# EasyEDA Pro project ProPrj_ENPHY-PCB-PROJECT-EN1B_2026-05-29.epro

# Schematic Schematic1
Board Name: Board1; Create Date: 2026-05-28; Page Name: P1; Project Name: ENPHY-PCB-PROJECT-EN1B; Schematic Name: Schematic1; Update Date: 2026-05-28; Company: EasyEDA.com; Page Size: A4; Version: V1.0
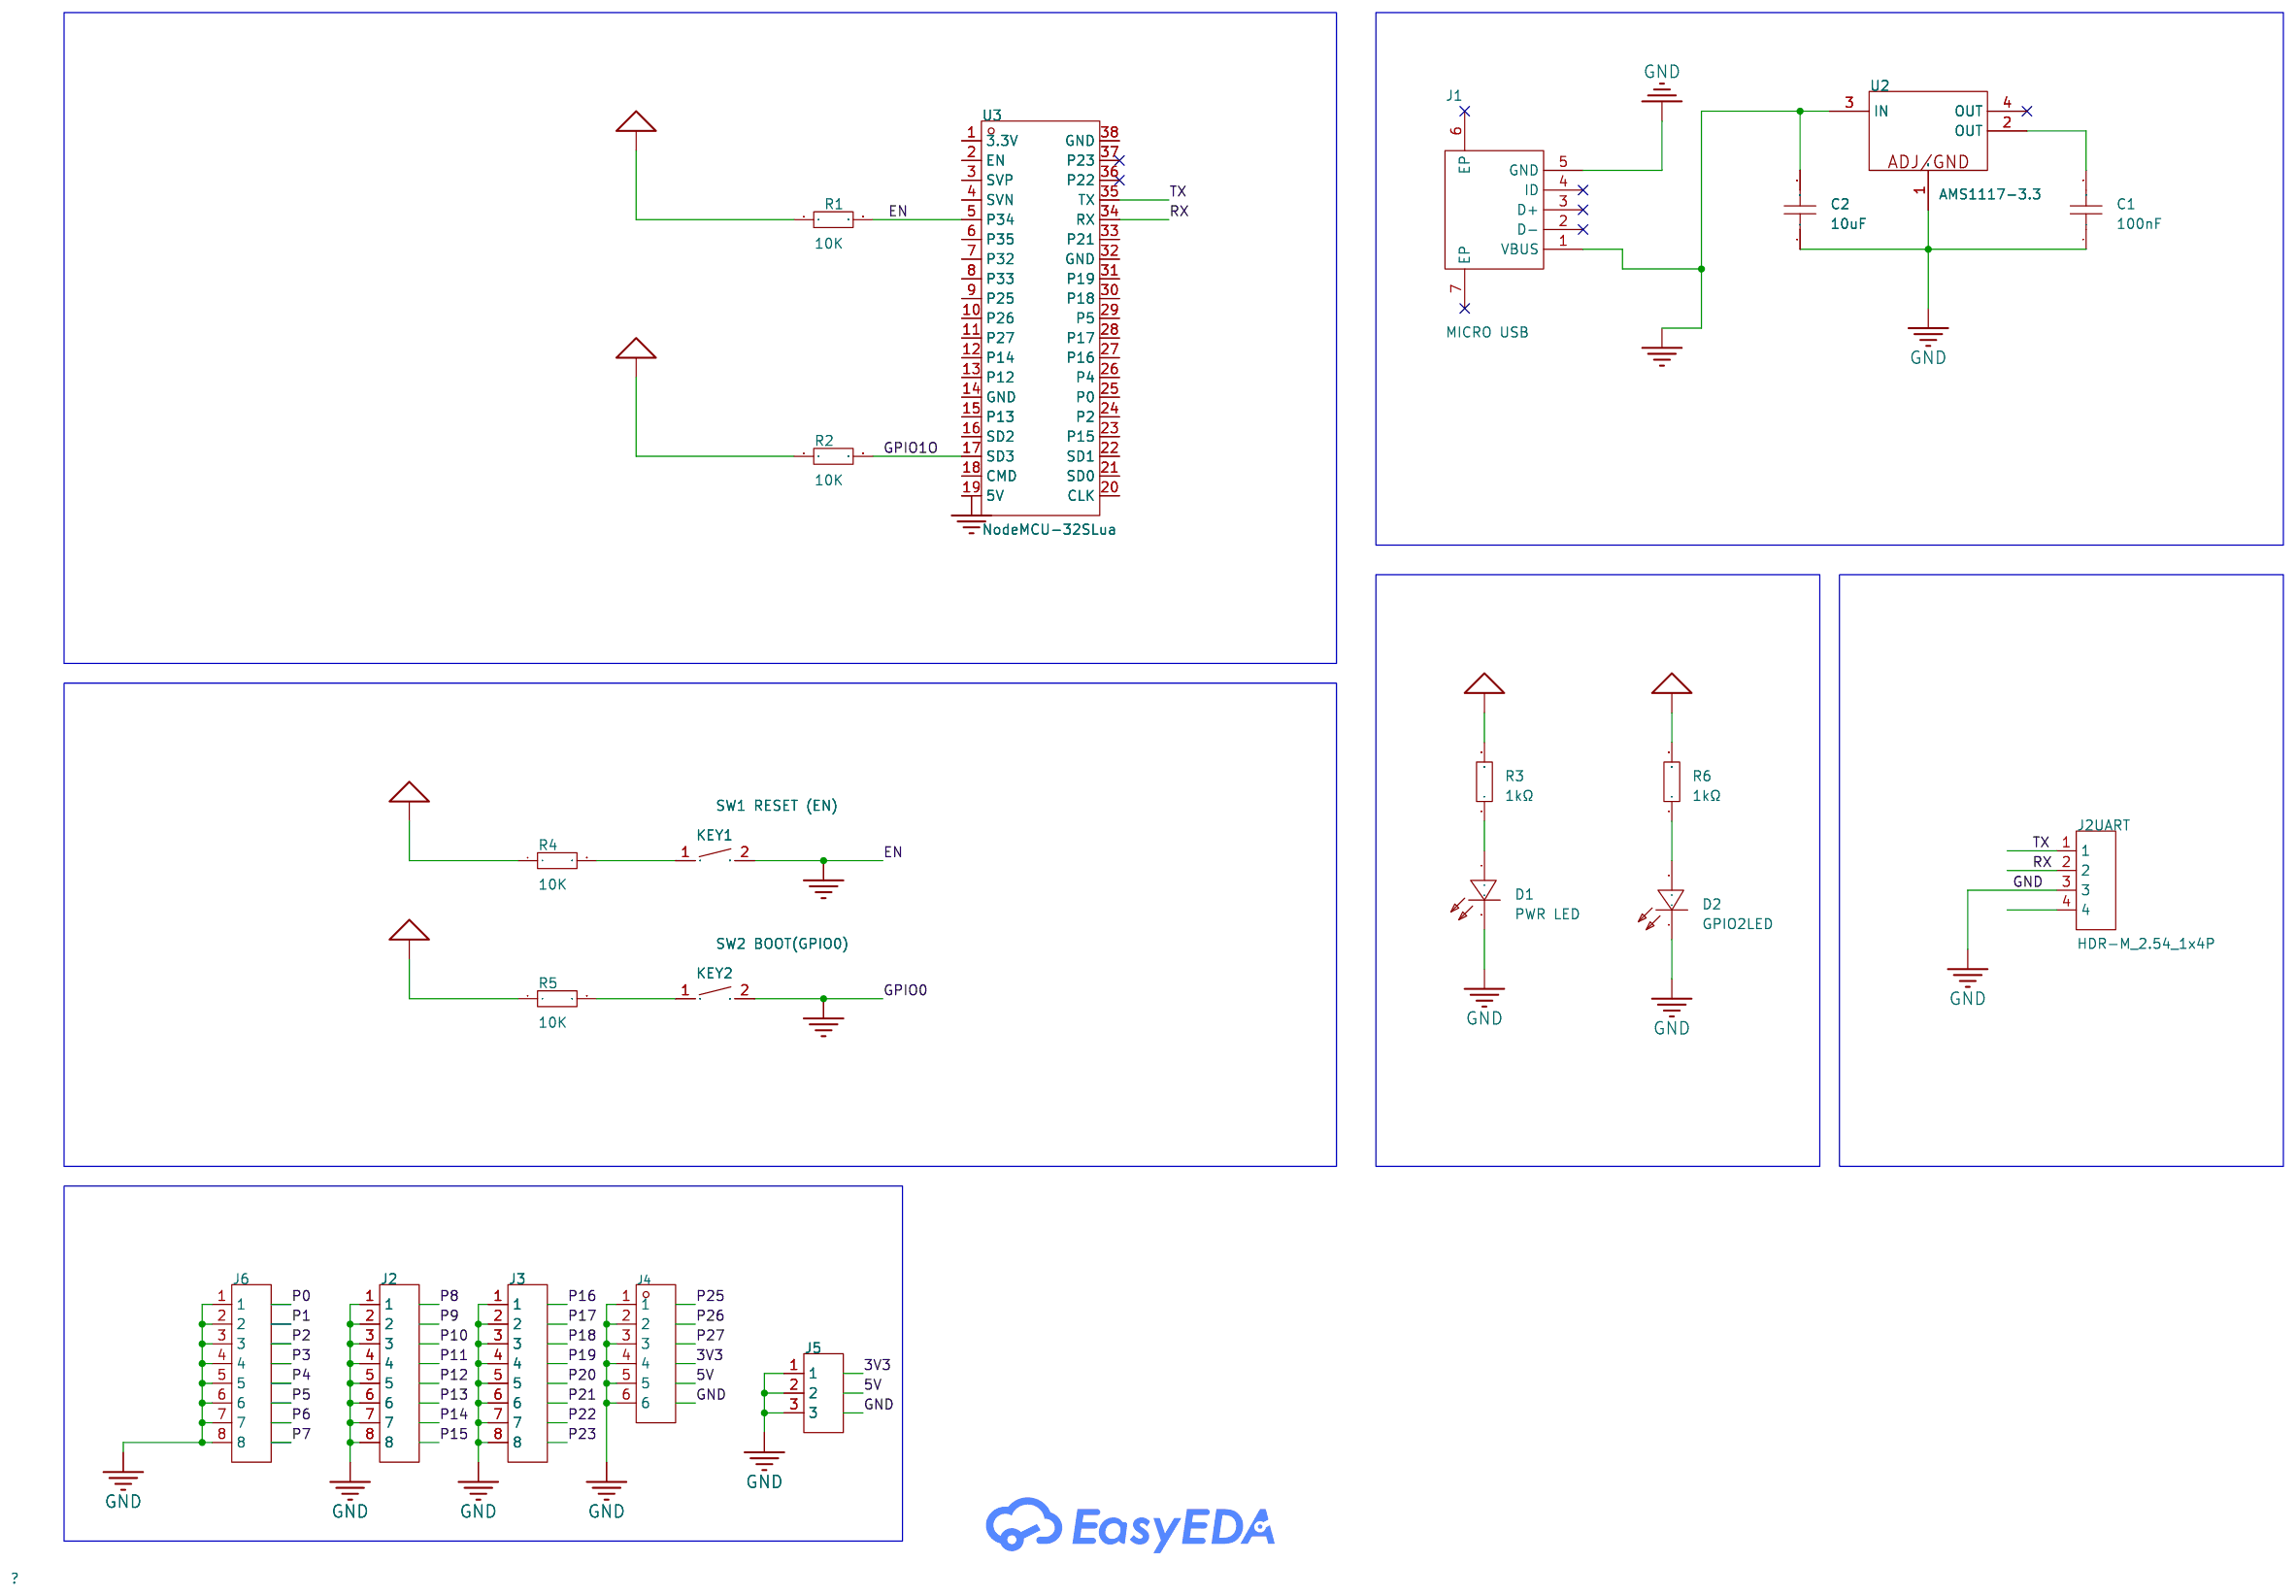
[diagram p0: schematic sheet]

## Parts
C1  100nF  [C0603]
C2  10uF  [C0603]
D1  PWR LED  [LED0603-R-RD]
D2  GPIO2LED  [LED0603-R-RD_WHITE]
J1  MICRO USB  [USB-MICRO_USB-MICRO-5P]
J2  -  [HDR-TH_8P-P2.54-V-F-1]
J2UART  HDR-M_2.54_1x4P  [HDR-TH_HDR-M_2.54_1X4P]
J3  -  [HDR-TH_8P-P2.54-V-F-1]
J4  -  [HDR-TH_6P-P2.54-V-F]
J5  -  [HDR-TH_3P-P2.54-V-F]
J6  -  [HDR-TH_8P-P2.54-V-F-1]
KEY1  SW1 RESET (EN)  [KEY-SMD_L4.0-W3.0-LS4.9-1]
KEY2  SW2 BOOT(GPIO0)  [KEY-SMD_L4.0-W3.0-LS4.9-1]
R1  10K  [R0603]
R2  10K  [R0603]
R3  1kΩ  [R0603]
R4  10K  [R0603]
R5  10K  [R0603]
R6  1kΩ  [R0805]
U2  AMS1117-3.3  [SOT-223-3_L6.4-W3.5-P2.30-LS7.0-BR]
U3  NodeMCU-32SLua  [COMM-TH_NODEMCU-32SLUA]

## Library data of the parts
C1 = CC0603KRX7R9BB104: Capacitance:100nF Tolerance:±10% Tolerance:±10% Voltage Rating:50V Temperature Coefficient:X7R; LCSC Part Name: 100nF ±10% 50V; Supplier Part: C14663; Manufacturer: YAGEO(国巨); Supplier Footprint: 0603; Datasheet: https://item.szlcsc.com/datasheet/CC0603KRX7R9BB104/15331.html; Supplier: LCSC; Tolerance: ±10%; Voltage Rating: 50V; Temperature Coefficient: X7R
C2 = CL10A106KP8NNNC: Capacitance:10uF Tolerance:±10% Tolerance:±10% Voltage Rating:10V Temperature Coefficient:X5R; LCSC Part Name: 10uF ±10% 10V; Supplier Part: C19702; Manufacturer: SAMSUNG(三星); Supplier Footprint: 0603; JLCPCB Part Class: Basic Part; Datasheet: https://item.szlcsc.com/datasheet/CL10A106KP8NNNC/20411.html; Supplier: LCSC; Tolerance: ±10%; Voltage Rating: 10V; Temperature Coefficient: X5R
D1 = LED0603-R: Supplier Part: C9900005326; Supplier Footprint: LED0603; JLCPCB Part Class: Extended Part; Supplier: LCSC
D2 = KT-0603W: Lamp Holder Type:1.6mm x 0.8mm square LED Illumination Color:White Voltage - Forward(Vf):2.6V~3.1V Voltage - Forward(Vf):2.6V~3.1V Power(Watts):100mW Forward Current:5mA Wavelength - Dominant:- Wavelength - Dominant:- Peak Wavelength:- Peak Wavelength:- D; LCSC Part Name: 0603 白灯 高亮; Supplier Part: C2290; Manufacturer: KENTO; Supplier Footprint: 0603; Datasheet: https://item.szlcsc.com/datasheet/KT-0603W/2663.html; Supplier: LCSC; Lamp Holder Type: 1.6mm x 0.8mm square LED; Illumination Color: White; Voltage - Forward(Vf): 2.6V~3.1V; Power(Watts): 100mW; Forward Current: 5mA; Diode Configuration: Discrete Diode; Lens Color: Yellow Lens; Color Temperature: 40000K~100000K; Luminous Intensity: 360mcd; Viewing Angle: 120°; Mounting Style: Top-mount; Operating Temperature: -40℃~+85℃
J1 = USB-Micro-5p_C9900014940: LCSC Part Name: USB-Micro-5p; Supplier Part: C9900014940; Manufacturer Part: USB-Micro-5p; Supplier Footprint: USB平口Micro脚长2; JLCPCB Part Class: Extended Part; Supplier: LCSC
J2 J3 J6 = HDR-F_2.54_1x8P: Supplier Footprint: Through
J2UART = HDR-M_2.54_1x4P_C9900236824: Supplier Part: C9900236824; Supplier Footprint: HDR-TH_4P-P2.54-V-M; JLCPCB Part Class: Extended Part; Supplier: LCSC
J4 = HDR-F_2.54_1x6P: Supplier Footprint: Through
J5 = HDR-F_2.54_1x3P: Supplier Footprint: Through
KEY1 KEY2 = SWITCH,TACT,1.57N,3.9X2.9MM: Supplier Part: C9900022258; Supplier Footprint: SW-SMD_2P-L4.0-W3.0; JLCPCB Part Class: Extended Part; Supplier: LCSC
R1 R2 R4 R5 = Res_0603: Supplier Footprint: 0603
R3 = 0603WAF1001T5E: Type:Thick Film Resistor Resistance:1kΩ Tolerance:±1% Tolerance:±1% Power(Watts):100mW Voltage-Supply(Max):75V Temperature Coefficient:±100ppm/℃ Temperature Coefficient:±100ppm/℃ Operating Temperature:-55℃~+155℃ Operating Temperature:-55℃~+155℃; LCSC Part Name: 1kΩ ±1% 100mW 厚膜电阻; Supplier Part: C21190; Manufacturer: UNI-ROYAL(厚声); Supplier Footprint: 0603; Datasheet: https://item.szlcsc.com/datasheet/0603WAF1001T5E/21904.html; Supplier: LCSC; Type: Thick Film Resistor; Tolerance: ±1%; Power(Watts): 100mW; Voltage-Supply(Max): 75V; Temperature Coefficient: ±100ppm/℃; Operating Temperature: -55℃~+155℃
R6 = 0805W8F1001T5E: Type:Thick Film Resistors Resistance:1kΩ Tolerance:±1% Tolerance:±1% Power(Watts): Overload Voltage (Max): Temperature Coefficient:±100ppm/℃ Temperature Coefficient:±100ppm/℃ Operating Temperature Range:-55℃~+155℃ Operating Temperature Range:-55℃~+155℃; LCSC Part Name: 1kΩ ±1% 125mW 厚膜电阻; Supplier Part: C17513; Manufacturer: UNI-ROYAL(厚声); Supplier Footprint: 0805; Datasheet: https://atta.szlcsc.com/upload/public/pdf/source/20200306/C422600_1E6D84923E4A46A82E41ADD87F860B5C.pdf; Supplier: LCSC; Type: Thick Film Resistors; Tolerance: ±1%; Temperature Coefficient: ±100ppm/℃; Operating Temperature Range: -55℃~+155℃
U2 = AMS1117-3.3: Output Type:Fixed Voltage - Supply:15V Output Voltage:3.3V Output Voltage:3.3V Output Current:1A Power Supply Rejection Ratio (PSRR):- Voltage Dropout:1.3V@(1A) standby current:4mA Features:Over Current Protection；Over Temperature Protection Operating Tem; LCSC Part Name: 1A低压差线性稳压器; Supplier Part: C2992570; Manufacturer: 国芯佳品; Supplier Footprint: SOT-223-3; JLCPCB Part Class: Extended Part; Datasheet: https://item.szlcsc.com/datasheet/AMS1117-3.3/3457622.html; Supplier: LCSC; Output Type: Fixed; Voltage - Supply: 15V; Output Voltage: 3.3V; Output Current: 1A; Voltage Dropout: 1.3V@(1A); standby current: 4mA; Features: Over Current Protection；Over Temperature Protection; Operating Temperature: -40℃~+125℃@(Ta); Output Configuration: Positive; Number of Outputs: 1
U3 = NodeMCU-32SLua: LCSC Part Name: NodeMCU-32S Lua; Supplier Part: C111436; Manufacturer: Ai-Thinker(安信可); Datasheet: https://atta.szlcsc.com/upload/public/pdf/source/20200715/C111436_7E615125D57381075B07FD61BFD5F595.pdf; Supplier: LCSC

## Nets
3V3: R1.1 R2.1 R3.2 R4.1 R5.1 U3.19(5V)
5V: C2.2 J1.1(VBUS) U2.3(IN)
GND: C1.1 C2.1 D1.2(K) D2.2(K) J1.5(GND) J2.1 J2.2 J2.3 J2.4 J2.5 J2.6 J2.7 J2.8 J2UART.3 J3.1 J3.2 J3.3 J3.4 J3.5 J3.6 J3.7 J3.8 J4.1 J4.2 J4.3 J4.4 J4.5 J4.6 J5.1 J5.2 J5.3 J6.1 J6.2 J6.3 J6.4 J6.5 J6.6 J6.7 J6.8 U2.1(ADJ/GND)
EN: KEY1.2 R1.2 U3.5(P34)
GPIO0: KEY2.2
GPIO1O: R2.2 U3.17(SD3)
GPIO2: R6.2
RX: J2UART.2 U3.34(RX)
TX: J2UART.1 U3.35(TX)
$1N1700: C1.2 U2.2(OUT)
$1N2509: KEY1.1 R4.2
$1N2514: KEY2.1 R5.2
$1N2836: D1.1(A) R3.1
$1N2914: D2.1(A) R6.1

Not connected (* = marked no-connect by the designer): J1 2(D-)* 3(D+)* 4(ID)* 6(EP)* 7(EP)*; J2UART 4; U2 4(OUT)*; U3 1(3.3V) 2(EN) 3(SVP) 4(SVN) 6(P35) 7(P32) 8(P33) 9(P25) 10(P26) 11(P27) 12(P14) 13(P12) 14(GND) 15(P13) 16(SD2) 18(CMD) 20(CLK) 21(SD0) 22(SD1) 23(P15) 24(P2) 25(P0) 26(P4) 27(P16) 28(P17) 29(P5) 30(P18) 31(P19) 32(GND) 33(P21) 36(P22)* 37(P23)* 38(GND)

# Board PCB1
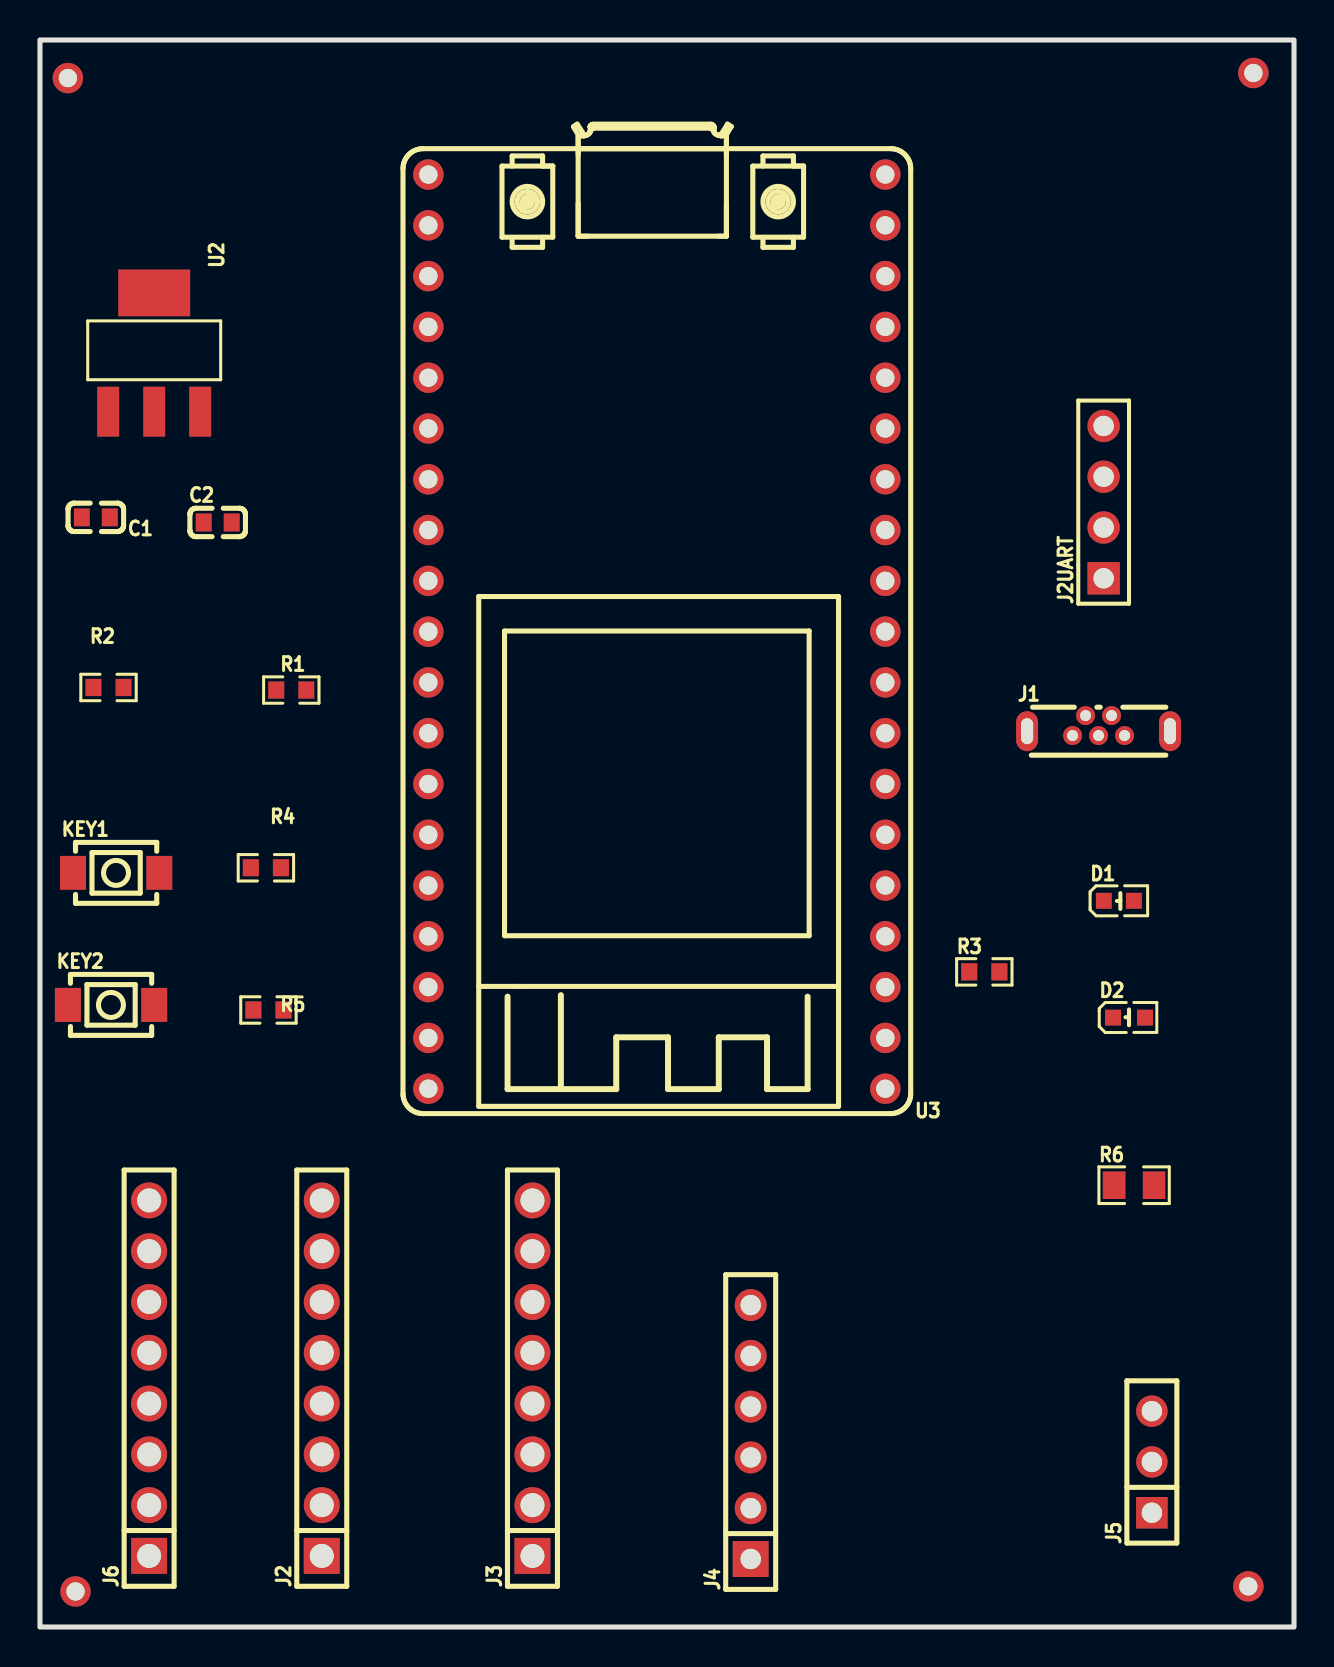
[diagram p1: board, top side]
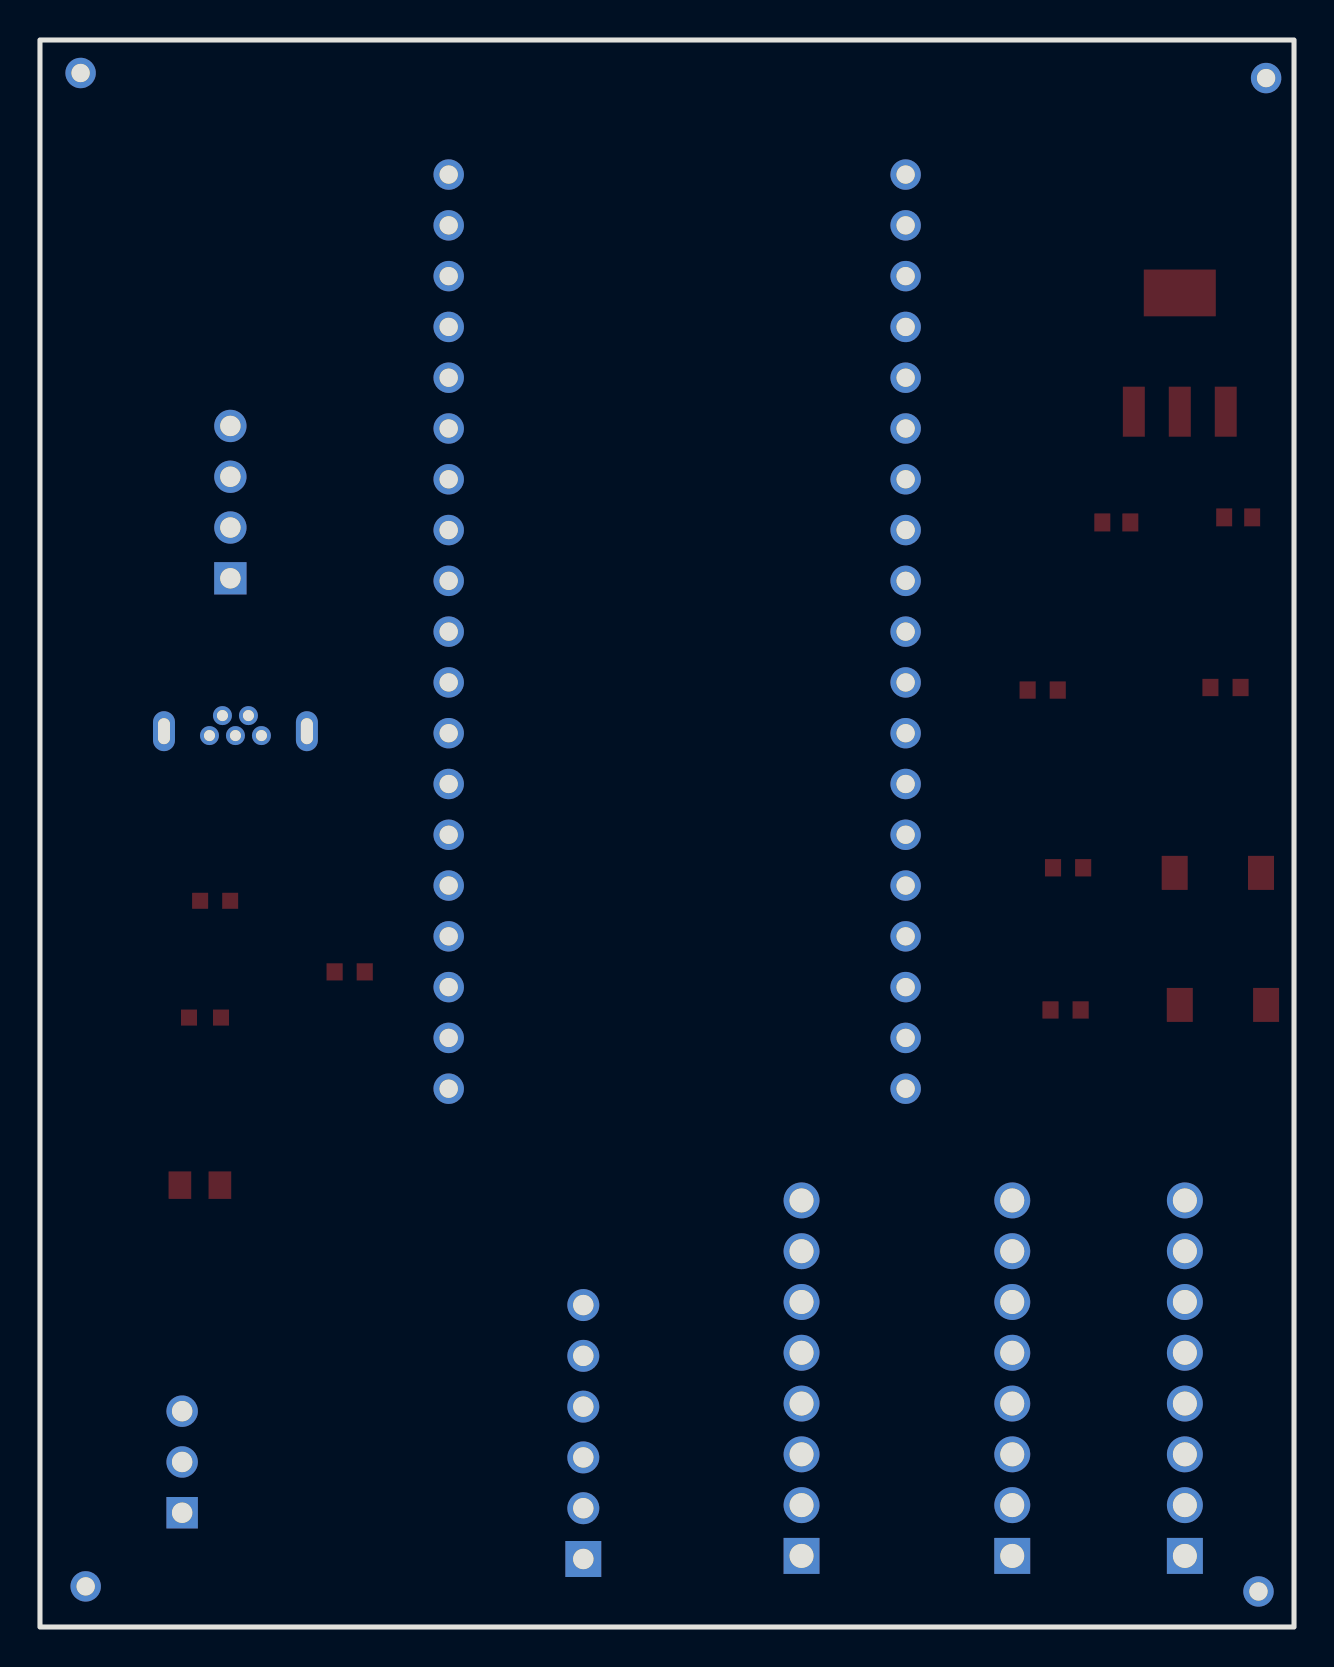
[diagram p2: board, bottom side, seen from below]

Outline 62.74 x 79.38 mm; copper layers: Top Layer, Bottom Layer. Coordinates in mm from the lower left corner of the outline.
Outline path: rectangle 0,79.38 62.74,0
Stack: Top Layer 0.035mm / Dielectric1 1.51mm FR4 er 4.5 / Bottom Layer 0.035mm

## Design rules (mm)
template: JLCPCB Capability(Two Layers Board)
spacing copperThickness1oz (default): track to track 0.102, other pairs 0.152 to 0.3
spacing copperThickness2oz: track to track 0.203, other pairs 0.152 to 0.3
track width copperThickness1oz (default): min 0.127, default 0.254, max 2.54
track width copperThickness2oz: min 0.203, default 0.254, max 2.54
differential pair differentialPair (default): width min 0.127, default 0.254, max 2.54; gap min 0.152, default 0.152
via viaSize (default): diameter min 0.5, default 0.61, max 10; hole min 0.3, default 0.305, max 6.3

## Placement (name value [footprint] x y rotation side)
C1  100nF  [C0603]  2.79 55.5 180 top
C2  10uF  [C0603]  8.89 55.25 0 top
D1  PWR LED  [LED0603-R-RD]  53.97 36.32 0 top
D2  GPIO2LED  [LED0603-R-RD_WHITE]  54.48 30.48 0 top
J1  MICRO USB  [USB-MICRO_USB-MICRO-5P]  52.96 45.08 0 top
J2  -  [HDR-TH_8P-P2.54-V-F-1]  14.1 12.45 90 top
J2UART  HDR-M_2.54_1x4P  [HDR-TH_HDR-M_2.54_1X4P]  53.21 56.26 90 top
J3  -  [HDR-TH_8P-P2.54-V-F-1]  24.64 12.45 90 top
J4  -  [HDR-TH_6P-P2.54-V-F]  35.56 9.75 90 top
J5  -  [HDR-TH_3P-P2.54-V-F]  55.63 8.25 90 top
J6  -  [HDR-TH_8P-P2.54-V-F-1]  5.46 12.45 90 top
KEY1  SW1 RESET (EN)  [KEY-SMD_L4.0-W3.0-LS4.9-1]  3.81 37.72 0 top
KEY2  SW2 BOOT(GPIO0)  [KEY-SMD_L4.0-W3.0-LS4.9-1]  3.56 31.11 0 top
NOREF  -  [Pad_e28]  60.71 77.72 0 top
NOREF#2  -  [Pad_e30]  60.45 2.03 0 top
NOREF#3  -  [Pad_e31]  1.78 1.78 0 top
NOREF#4  -  [Pad_e29]  1.4 77.47 0 top
R1  10K  [R0603]  12.57 46.86 0 top
R2  10K  [R0603]  3.43 46.99 0 top
R3  1kΩ  [R0603]  47.24 32.77 0 top
R4  10K  [R0603]  11.3 37.97 0 top
R5  10K  [R0603]  11.43 30.86 0 top
R6  1kΩ  [R0805]  54.74 22.1 0 top
U2  AMS1117-3.3  [SOT-223-3_L6.4-W3.5-P2.30-LS7.0-BR]  5.72 63.75 270 top
U3  NodeMCU-32SLua  [COMM-TH_NODEMCU-32SLUA]  30.86 49.78 180 top

## Footprints (pads in the part's own frame, mm; a bottom-side part is the same pattern mirrored in y, then rotated)
C0603
  rect 0.8x0.9 smd: 1(-0.7,0) 2(0.7,0)
COMM-TH_NODEMCU-32SLUA
  round 1.524 hole 0.914: 1(-11.43,22.86) 2(-11.43,20.32) 3(-11.43,17.78) 4(-11.43,15.24) 5(-11.43,12.7) 6(-11.43,10.16) 7(-11.43,7.62) 8(-11.43,5.08) 9(-11.43,2.54) 10(-11.43,0) 11(-11.43,-2.54) 12(-11.43,-5.08) 13(-11.43,-7.62) 14(-11.43,-10.16) 15(-11.43,-12.7) 16(-11.43,-15.24) 17(-11.43,-17.78) 18(-11.43,-20.32) 19(-11.43,-22.86) 20(11.43,-22.86) 21(11.43,-20.32) 22(11.43,-17.78) 23(11.43,-15.24) 24(11.43,-12.7) 25(11.43,-10.16) 26(11.43,-7.62) 27(11.43,-5.08) 28(11.43,-2.54) 29(11.43,0) 30(11.43,2.54) 31(11.43,5.08) 32(11.43,7.62) 33(11.43,10.16) 34(11.43,12.7) 35(11.43,15.24) 36(11.43,17.78) 37(11.43,20.32) 38(11.43,22.86)
HDR-TH_3P-P2.54-V-F
  rect 1.575x1.575 hole 1.02: 1(-2.54,0)
  round 1.575 hole 1.02: 2(0,0) 3(2.54,0)
HDR-TH_6P-P2.54-V-F
  rect 1.8x1.8 hole 1.02: 1(-6.35,0)
  round 1.6 hole 1.02: 2(-3.81,0) 3(-1.27,0) 4(1.27,0) 5(3.81,0) 6(6.35,0)
HDR-TH_8P-P2.54-V-F-1
  rect 1.8x1.8 hole 1.2: 1(-8.89,0)
  round 1.8 hole 1.2: 2(-6.35,0) 3(-3.81,0) 4(-1.27,0) 5(1.27,0) 6(3.81,0) 7(6.35,0) 8(8.89,0)
HDR-TH_HDR-M_2.54_1X4P
  rect 1.62x1.62 hole 1.02: 1(-3.81,0)
  round 1.62 hole 1.02: 2(-1.27,0) 3(1.27,0) 4(3.81,0)
KEY-SMD_L4.0-W3.0-LS4.9-1
  rect 1.3x1.7 smd: 1(-2.159,0) 2(2.159,0)
LED0603-R-RD
  rect 0.8x0.8 smd: 1(0.751,0) 2(-0.751,0)
LED0603-R-RD_WHITE
  rect 0.8x0.8 smd: 1(0.8,0) 2(-0.8,0)
Pad_e28
  round 1.524 hole 0.914: 1(0,0)
Pad_e29
  round 1.524 hole 0.914: 2(0,0)
Pad_e30
  round 1.524 hole 0.914: 3(0,0)
Pad_e31
  round 1.524 hole 0.914: 4(0,0)
R0603
  rect 0.806x0.864 smd: 1(-0.753,0) 2(0.753,0)
R0805
  rect 1.133x1.377 smd: 1(-1,0) 2(1,0)
SOT-223-3_L6.4-W3.5-P2.30-LS7.0-BR
  rect 2.5x1.1 smd: 1(2.97,-2.3) 2(2.97,0) 3(2.97,2.3)
  rect 2.34x3.6 smd: 4(-2.97,0)
USB-MICRO_USB-MICRO-5P
  round 0.95 hole 0.55: 1(-1.3,-0.5) 2(-0.65,0.5) 3(0,-0.5) 4(0.65,0.5) 5(1.3,-0.5)
  oval 1.1x2 hole 0.6x1.3: 6(-3.575,-0.28) 7(3.575,-0.28)

## Nets
As in the schematic.

Pads without a net: J1 2 3 4 6 7; NOREF 1; NOREF#2 3; NOREF#3 4; NOREF#4 2; U2 4; U3 1 2 3 4 6 7 8 9 10 11 12 13 14 15 16 18 20 21 22 23 24 25 26 27 28 29 30 31 32 33 36 37 38
